# EAGLE design ELE-T200 (EAGLE 4.11)
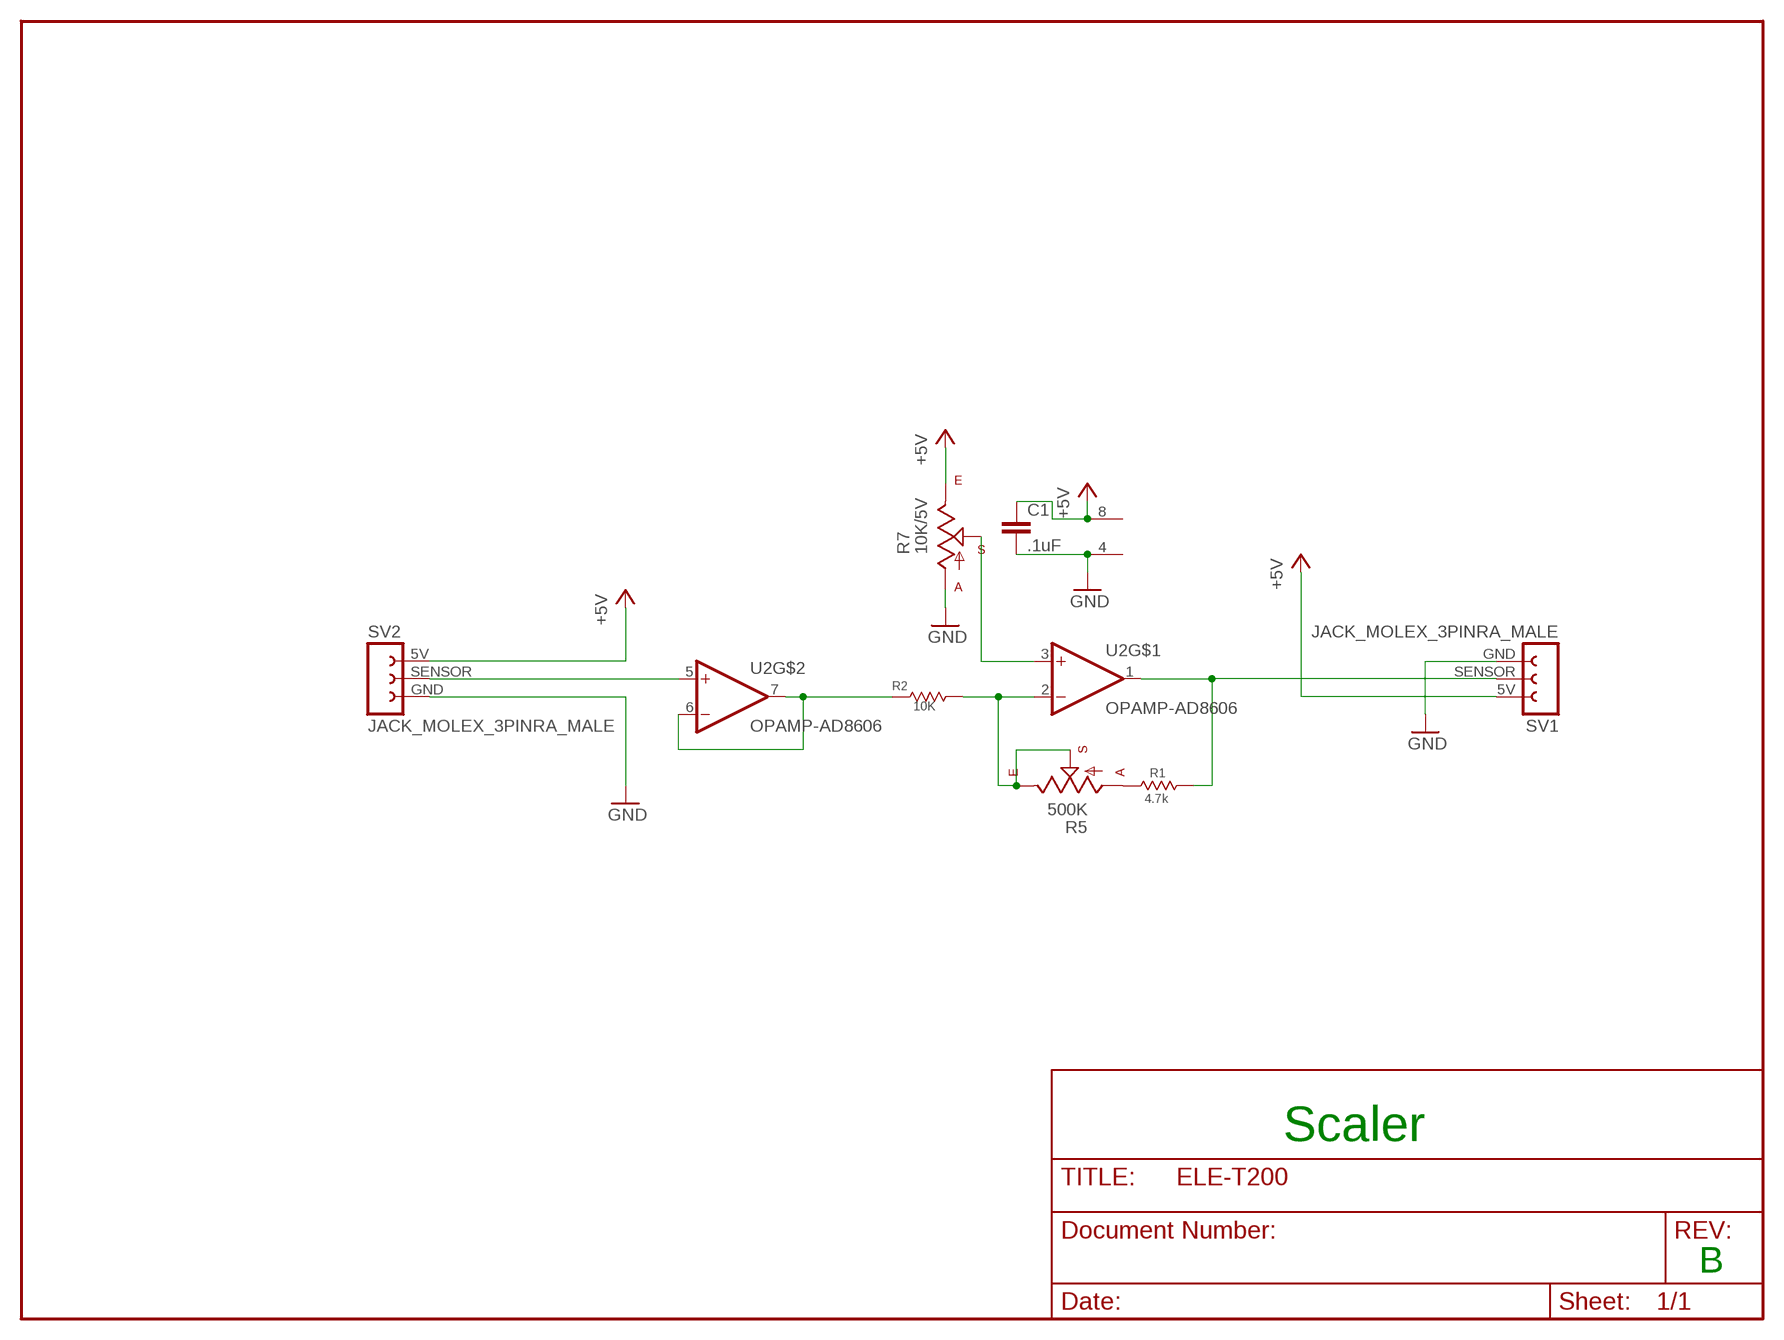
[diagram p0: schematic, sheet 1]

## Parts
C1  .1uF  CAP_CERAMIC_0805_0603  [C0603]
R1  4.7k  R-US_R0603  [R0603]
R2  10K  R-US_R0603  [R0603]
R5  500K  POT_GENERIC  [POT_0_1_GENERIC]
R7  10K/5V  POT_GENERIC  [POT_0_1_GENERIC]
SV1  JACK_MOLEX_3PINRA_MALE  [JACK_MOLEX_3PIN_RA]
SV2  JACK_MOLEX_3PINRA_MALE  [JACK_MOLEX_3PIN_RA]
U2  OPAMP-AD8606  [SOIC8]

## Nets
+5V: C1.1 R7.3(E) SV1.5V SV2.5V U2.8(V+)
GND: C1.2 R7.1(A) SV1.GND SV2.GND U2.4(V-)
N$1: R7.2(WIPER)(S) U2.3(+IN)
N$2: R1.2 SV1.SENSOR U2.1(OUT)
N$3: R1.1 R5.1(A)
N$4: R2.2 R5.2(WIPER)(S) R5.3(E) U2.2(-IN)
N$5: R2.1 U2.6(-IN) U2.7(OUT)
N$6: SV2.SENSOR U2.5(+IN)

## Notes on the sheet
- Scaler
- B

## Library data of the parts
C1 = TEABOX-LIB:CAP_CERAMIC_0805
R1 R2 = rcl:R-US_: RESISTOR, American symbol
R5 R7 = TEABOX-LIB:POT_GENERIC
SV1 SV2 = TEABOX-LIB:JACK_MOLEX_3PIN
U2 = TEABOX-LIB:OPAMP-AD8606

## Board
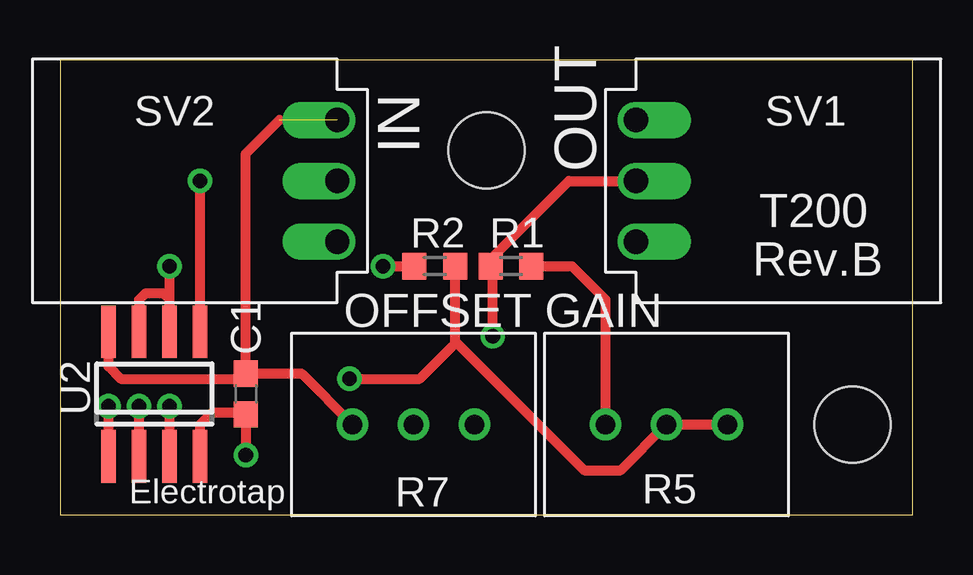
[diagram p1: board, top side]
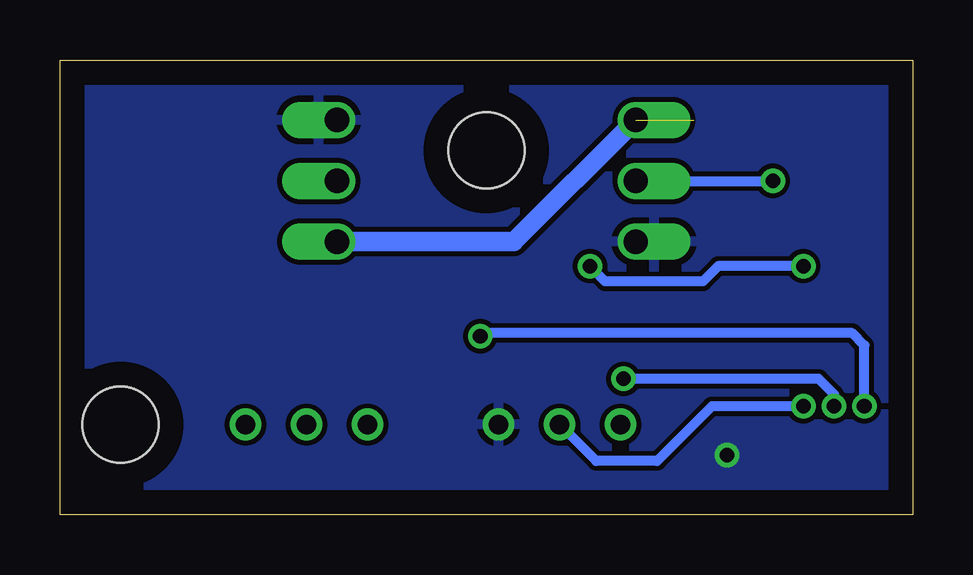
[diagram p2: board, bottom side, seen from below]

Size 35.54 x 18.97 mm. Coordinates in mm from the lower left corner, seen from the top.
Outline: 0,0 35.54,0 35.54,18.97 0,18.97 0,0
Copper layers (1*16): Top 0.035mm / dielectric 1.5mm / Bottom 0.035mm
Design rules "default": minimum track width 10mil, minimum drill 24mil, track to track 8mil, track to pad 8mil, pad to pad 8mil, via to via 8mil, smd to smd 8mil, copper to edge 40mil, drill to drill 8mil, minimum pad ring 10mil, minimum via ring 8mil, stop-mask expansion 4mil, vias tented up to drill 0mil, thermal gap 10mil
Holes 3.17 mm at 33.02,3.77 17.78,15.2

### Footprints (pad centres in the part's own frame; a part is rotated, then mirrored left to right if it is on the bottom)
C0603 = smd 1.1 x 1: 1 -0.85,0; 2 0.85,0
R0603 = smd 1 x 1.1: 1 -0.85,0; 2 0.85,0
POT_0_1_GENERIC = drill 0.813 round: 1 -2.54,1.27; 2(WIPER) 0,1.27; 3 2.54,1.27
JACK_MOLEX_3PIN_RA = drill 1.016 offset: 5V 0,0; GND 0,5.08; SENSOR 0,2.54
SOIC8 = smd 0.6 x 2.2: 1 -1.905,-2.6; 2 -0.635,-2.6; 3 0.635,-2.6; 4 1.905,-2.6; 5 1.905,2.6; 6 0.635,2.6; 7 -0.635,2.6; 8 -1.905,2.6

### Placement (x,y rotation side)
C1  7.74,5.04 270 top
R1  18.79,10.38 180 top
R2  15.62,10.38 0 top
R5  25.27,2.5 0 top
R7  14.73,5.04 180 top
SV1  24,11.39 0 top
SV2  11.55,16.47 180 top
U2  3.93,5.04 0 top

### Tracks (layer width: path | path; a pad name or v marks a point on that pad's centre or on a via)
+5V  (1 unrouted)
  Top 0.406: C1.1 7.74,15.07 9.14,16.47 | U2.8 2.03,6.19 2.54,5.68 7.74,5.68 C1.1 | C1.1 10.07,5.89 R7.3
  Bottom 0.813: 24.12,11.39 SV1.5V 16.63,11.39 SV2.5V
GND  (via drill 0.61)
  Top 0.406: v7.74,2.5 C1.2 7.74,4.28 6.34,4.28 5.84,3.77 U2.4
  pour Bottom: -0.01,-0.04 -0.01,19.01 35.55,19.01 35.55,-0.04
N$1  (via drill 0.61)
  Top 0.406: U2.3 v4.57,4.53
  Bottom 0.406: v4.57,4.53 8.38,4.53 10.66,2.25 13.2,2.25 R7.2(WIPER)
N$2  (via drill 0.61)
  Top 0.406: U2.1 v2.03,4.53 | v18.03,7.46 18.03,10.25 17.9,10.38 R1.2 17.94,10.67 21.2,13.93 SV1.SENSOR
  Bottom 0.406: v2.03,4.53 2.03,7.07 2.54,7.58 17.9,7.58 v18.03,7.46
N$3
  Top 0.406: R1.1 21.33,10.38 22.73,8.98 R5.1
N$4  (via drill 0.61)
  Top 0.406: R5.3 R5.2(WIPER) 23.36,1.87 21.84,1.87 16.51,7.2 | R2.2 16.47,7.24 16.51,7.2 | U2.2 v3.3,4.53 | v12.06,5.68 14.98,5.68 16.51,7.2
  Bottom 0.406: v3.3,4.53 3.3,5.04 3.93,5.68 v12.06,5.68
N$5  (via drill 0.61)
  Top 0.406: U2.7 3.3,8.98 3.55,9.23 4.31,9.23 4.57,8.98 U2.6 v4.57,10.38 | v13.46,10.38 R2.1
  Bottom 0.406: v4.57,10.38 8.12,10.38 8.76,9.74 12.82,9.74 v13.46,10.38
N$6  (via drill 0.61)
  Top 0.406: U2.5 v5.84,13.93
  Bottom 0.406: SV2.SENSOR v5.84,13.93

### Text on the board
tPlace: IN | OUT | T200 | Rev.B | OFFSET | GAIN | Electrotap